# EAGLE design untitled (EAGLE 9.6.2)
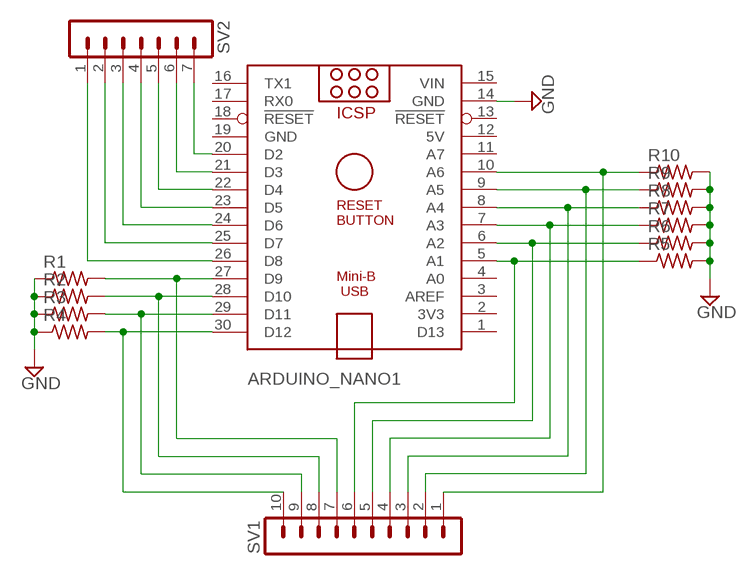
[diagram p0: schematic, sheet 1]

## Parts
ARDUINO_NANO1  ARDUINO_NANO  [ARDUINO_NANO]
R1  R-US_0309/12  [0309/12]
R2  R-US_0309/12  [0309/12]
R3  R-US_0309/12  [0309/12]
R4  R-US_0309/12  [0309/12]
R5  R-US_0309/12  [0309/12]
R6  R-US_0309/12  [0309/12]
R7  R-US_0309/12  [0309/12]
R8  R-US_0309/12  [0309/12]
R9  R-US_0309/12  [0309/12]
R10  R-US_0309/12  [0309/12]
SV1  MA10-1  [MA10-1]
SV2  MA07-1  [MA07-1]

## Nets
GND: ARDUINO_NANO1.14(GND) R1.1 R2.1 R3.1 R4.1 R5.2 R6.2 R7.2 R8.2 R9.2 R10.2
N$1: ARDUINO_NANO1.30(D12) R4.2 SV1.10
N$2: ARDUINO_NANO1.29(D11) R3.2 SV1.9
N$3: ARDUINO_NANO1.28(D10) R2.2 SV1.8
N$4: ARDUINO_NANO1.27(D9) R1.2 SV1.7
N$5: ARDUINO_NANO1.5(A1) R5.1 SV1.6
N$6: ARDUINO_NANO1.6(A2) R6.1 SV1.5
N$7: ARDUINO_NANO1.7(A3) R7.1 SV1.4
N$8: ARDUINO_NANO1.8(A4) R8.1 SV1.3
N$9: ARDUINO_NANO1.9(A5) R9.1 SV1.2
N$10: ARDUINO_NANO1.10(A6) R10.1 SV1.1
N$11: ARDUINO_NANO1.26(D8) SV2.1
N$12: ARDUINO_NANO1.25(D7) SV2.2
N$13: ARDUINO_NANO1.24(D6) SV2.3
N$14: ARDUINO_NANO1.23(D5) SV2.4
N$15: ARDUINO_NANO1.22(D4) SV2.5
N$16: ARDUINO_NANO1.21(D3) SV2.6
N$17: ARDUINO_NANO1.20(D2) SV2.7
Unconnected: ARDUINO_NANO1.1(D13) ARDUINO_NANO1.2(3V3) ARDUINO_NANO1.3(AREF) ARDUINO_NANO1.4(A0) ARDUINO_NANO1.11(A7) ARDUINO_NANO1.13(!RESET) ARDUINO_NANO1.16(TX1) ARDUINO_NANO1.17(RX0) ARDUINO_NANO1.18(!RESET)

## Power pins joined to a net without a drawn wire
5V: ARDUINO_NANO1.12(5V)
GND: ARDUINO_NANO1.19(GND)
VIN: ARDUINO_NANO1.15(VIN)

## Library data of the parts
ARDUINO_NANO1 = ArduinoNanoV30:ARDUINO_NANO: Arduino Nano V3.0 Overview: The Arduino Nano is a small, complete, and breadboard-friendly board based on the ATmega328 (Arduino Nano 3.x) or ATmega168 (Arduino Nano 2.x). It has more or less the same functionality of the Arduino Duemilanove, but in a different package. It lacks only a DC power jack, and works with a Mini-B USB cable instead of a standard one. The Nano was designed and is being produced by Gravitech. Specifications: Microcontroller Atmel ATmega168 or ATmega328 Operating Voltage (logic level) 5 V Input Voltage (recommended) 7-12 V Input Voltage (limits) 6-20 V Digital I/O Pins 14 (of which 6 provide PWM output) Analog Input Pins 8 DC Current per I/O Pin 40 mA Flash Memory 16 KB (ATmega168) or 32 KB (ATmega328) of which 2 KB used by bootloader SRAM 1 KB (ATmega168) or 2 KB (ATmega328) EEPROM 512 bytes (ATmega168) or 1 KB (ATmega328) Clock Speed 16 MHz Dimensions 0.73" x 1.70" Length 45 mm Width 18 mm Weigth 5 g Power: The Arduino Nano can be powered via the Mini-B USB connection, 6-20V unregulated external power supply (pin 30), or 5V regulated external power supply (pin 27). The power source is automatically selected to the highest voltage source. Memory: The ATmega168 has 16 KB of flash memory for storing code (of which 2 KB is used for the bootloader); the ATmega328 has 32 KB, (also with 2 KB used for the bootloader). The ATmega168 has 1 KB of SRAM and 512 bytes of EEPROM (which can be read and written with the EEPROM library); the ATmega328 has 2 KB of SRAM and 1 KB of EEPROM. Input and Output: Each of the 14 digital pins on the Nano can be used as an input or output, using pinMode(), digitalWrite(), and digitalRead() functions. They operate at 5 volts. Each pin can provide or receive a maximum of 40 mA and has an internal pull-up resistor (disconnected by default) of 20-50 kOhms. In addition, some pins have specialized functions. Visit Arduino - ArduinoBoardNano <https://www.arduino.cc/en/Main/ArduinoBoardNano>
R1-R10 = rcl:R-US_: RESISTOR, American symbol; SPICEPREFIX: R
SV1 = con-lstb:MA10-1: PIN HEADER; OC_FARNELL: unknown; OC_NEWARK: unknown
SV2 = con-lstb:MA07-1: PIN HEADER; OC_FARNELL: unknown; OC_NEWARK: unknown

## Board
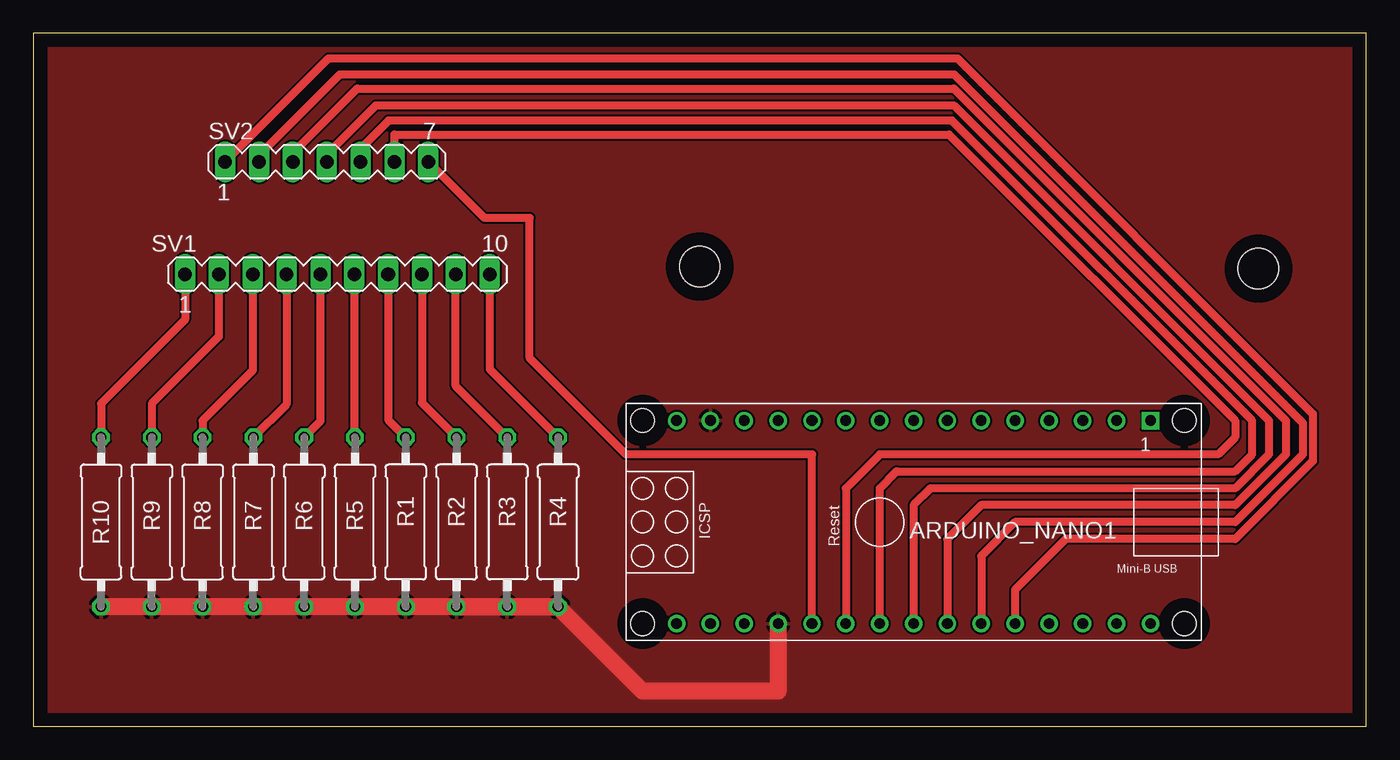
[diagram p1: board, top side]
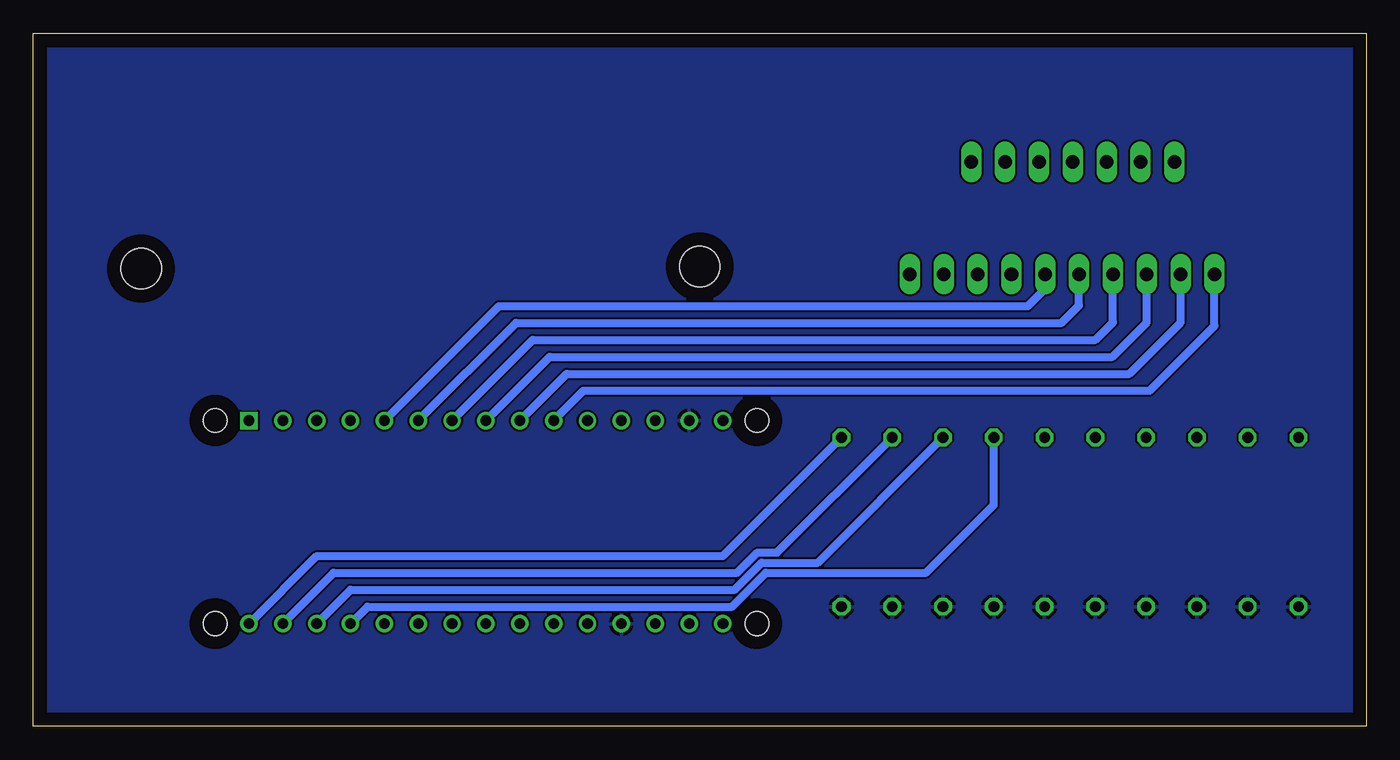
[diagram p2: board, bottom side, seen from below]

Size 100 x 52 mm. Coordinates in mm from the lower left corner, seen from the top.
Outline: 0,0 100,0 100,52 0,52 0,0
Copper layers (1*16): Top 0.035mm / dielectric 1.5mm / Bottom 0.035mm
Design rules "default": minimum track width 6mil, minimum drill 0.35mm, track to track 6mil, track to pad 6mil, pad to pad 6mil, via to via 6mil, smd to smd 6mil, copper to edge 40mil, drill to drill 6mil, minimum pad ring 10mil, minimum via ring 8mil, stop-mask expansion 4mil, vias tented up to drill 0mil, thermal gap 10mil
Holes 3.05 mm at 91.92,34.35 50,34.5

### Footprints (pad centres in the part's own frame; a part is rotated, then mirrored left to right if it is on the bottom)
ARDUINO_NANO = drill 0.8 square: 1 -20.32,-7.62 | drill 0.8: 2 -17.78,-7.62; 3 -15.24,-7.62; 4 -12.7,-7.62; 5 -10.16,-7.62; 6 -7.62,-7.62; 7 -5.08,-7.62; 8 -2.54,-7.62; 9 0,-7.62; 10 2.54,-7.62; 11 5.08,-7.62; 12 7.62,-7.62; 13 10.16,-7.62; 14 12.7,-7.62; 15 15.24,-7.62; 16 15.24,7.62; 17 12.7,7.62; 18 10.16,7.62; 19 7.62,7.62; 20 5.08,7.62; 21 2.54,7.62; 22 0,7.62; 23 -2.54,7.62; 24 -5.08,7.62; 25 -7.62,7.62; 26 -10.16,7.62; 27 -12.7,7.62; 28 -15.24,7.62; 29 -17.78,7.62; 30 -20.32,7.62 | hole 1.778: -22.86,-7.62; -22.86,7.62; 17.78,7.62; 17.78,-7.62
0309/12 = drill 0.813 octagon: 1 -6.35,0; 2 6.35,0
MA10-1 = drill 1.016 long: 1 -11.43,0; 2 -8.89,0; 3 -6.35,0; 4 -3.81,0; 5 -1.27,0; 6 1.27,0; 7 3.81,0; 8 6.35,0; 9 8.89,0; 10 11.43,0
MA07-1 = drill 1.016 long: 1 -7.62,0; 2 -5.08,0; 3 -2.54,0; 4 0,0; 5 2.54,0; 6 5.08,0; 7 7.62,0

### Placement (x,y rotation side)
ARDUINO_NANO1  63.5,15.32 180 top
R1  27.94,15.32 90 top
R2  31.75,15.32 90 top
R3  35.56,15.32 90 top
R4  39.37,15.32 90 top
R5  24.13,15.32 270 top
R6  20.32,15.32 270 top
R7  16.51,15.32 270 top
R8  12.7,15.32 270 top
R9  8.89,15.32 270 top
R10  5.08,15.32 270 top
SV1  22.81,33.93 0 top
SV2  22.01,42.36 0 top

### Tracks (layer width: path | path; a pad name or v marks a point on that pad's centre or on a via)
GND
  Top 1.27: ARDUINO_NANO1.19 55.88,2.62 45.72,2.62 R4.1 | R1.1 R2.1 R3.1 R4.1 | R4.1 R5.2 R6.2 R7.2 R8.2 R9.2 R10.2
  pour Bottom: 1,51 1,1 99,1 99,51
  pour Top: 1,51 1,1 99,1 99,51
N$1
  Top 0.61: SV1.10 34.24,26.8 R4.2
  Bottom 0.61: ARDUINO_NANO1.30 78.74,12.78 48.26,12.78 R4.2
N$2
  Top 0.61: SV1.9 31.7,25.53 R3.2
  Bottom 0.61: ARDUINO_NANO1.29 77.47,11.51 47.19,11.51 45.67,13.03 44.2,13.03 R3.2
N$3
  Top 0.61: SV1.8 29.16,24.26 R2.2
  Bottom 0.61: ARDUINO_NANO1.28 76.2,10.24 47.38,10.24 45.35,12.27 41.15,12.27 R2.2
N$4
  Top 0.61: SV1.7 26.62,22.99 R1.2
  Bottom 0.61: ARDUINO_NANO1.27 74.93,8.97 47.58,8.97 45.03,11.51 33.02,11.51 27.94,16.59 R1.2
N$5
  Top 0.61: R5.1 24.08,21.72 SV1.6
  Bottom 0.61: ARDUINO_NANO1.5 65.07,31.53 25.4,31.53 24.08,32.85 SV1.6
N$6
  Top 0.61: R6.1 21.54,22.89 SV1.5
  Bottom 0.61: SV1.5 21.54,31.58 22.86,30.26 63.8,30.26 ARDUINO_NANO1.6
N$7
  Top 0.61: SV1.4 19,24.16 R7.1
  Bottom 0.61: SV1.4 19,30.31 20.32,28.99 62.53,28.99 ARDUINO_NANO1.7
N$8
  Top 0.61: SV1.3 16.46,26.7 12.7,22.94 R8.1
  Bottom 0.61: ARDUINO_NANO1.8 61.26,27.72 19.05,27.72 16.46,30.31 SV1.3
N$9
  Top 0.61: R9.1 8.89,24.21 13.92,29.24 SV1.2
  Bottom 0.61: ARDUINO_NANO1.9 59.99,26.45 17.78,26.45 13.92,30.31 SV1.2
N$10
  Top 0.61: SV1.1 11.38,30.51 5.08,24.21 R10.1
  Bottom 0.61: ARDUINO_NANO1.10 58.72,25.18 16.24,25.18 11.38,30.04 SV1.1
N$11
  Top 0.61: SV2.1 22.15,50.12 69.34,50.12 96.01,23.45 96.01,19.89 90.17,14.05 77.47,14.05 73.66,10.24 ARDUINO_NANO1.26
N$12
  Top 0.61: SV2.2 16.93,42.84 23.01,48.93 69.07,48.93 95.25,22.75 95.25,20.4 90.17,15.32 73.66,15.32 71.12,12.78 ARDUINO_NANO1.25
N$13
  Top 0.61: SV2.3 19.47,43.02 24.31,47.86 69.06,47.86 93.98,22.94 93.98,20.4 90.17,16.59 71.12,16.59 68.58,14.05 ARDUINO_NANO1.24
N$14
  Top 0.61: SV2.4 22.01,42.89 25.7,46.59 69.06,46.59 92.71,22.94 92.71,20.4 90.17,17.86 67.31,17.86 66.04,16.59 ARDUINO_NANO1.23
N$15
  Top 0.61: ARDUINO_NANO1.22 63.5,17.86 64.77,19.13 90.17,19.13 91.44,20.4 91.44,22.94 68.93,45.45 26.64,45.45 24.55,43.35 SV2.5
N$16
  Top 0.61: SV2.6 27.09,44.41 68.7,44.41 90.17,22.94 90.17,21.67 88.9,20.4 63.5,20.4 60.96,17.86 ARDUINO_NANO1.21
N$17
  Top 0.61: ARDUINO_NANO1.20 58.42,20.4 44.45,20.4 37.24,27.61 37.24,38.14 33.85,38.14 SV2.7